# Altium schematic sheet usb-debug.SchDoc: Jetson Xavier NX Board
size A3; PageSetup: Record=PageOptions|CenterHorizontal=True|CenterVertical=True|PrintScale=0.97|XCorrection=1.00|YCorrection=1.00|PrintKind=1|BorderSize=5000000|LeftOffset=0|BottomOffset=0|Orientation=2|PaperLength=2970|PaperWidth=2100|Scale=100|PaperSource=7|PrintQuality=600|MediaType=1|DitherType=10|PaperKind=A4|PrintScaleMode=1; Organization: Altium Limited; Address1: 3 Minna Close; Address2: Belrose; Address3: NSW 2085; Address4: Australia; Revision: Rev01
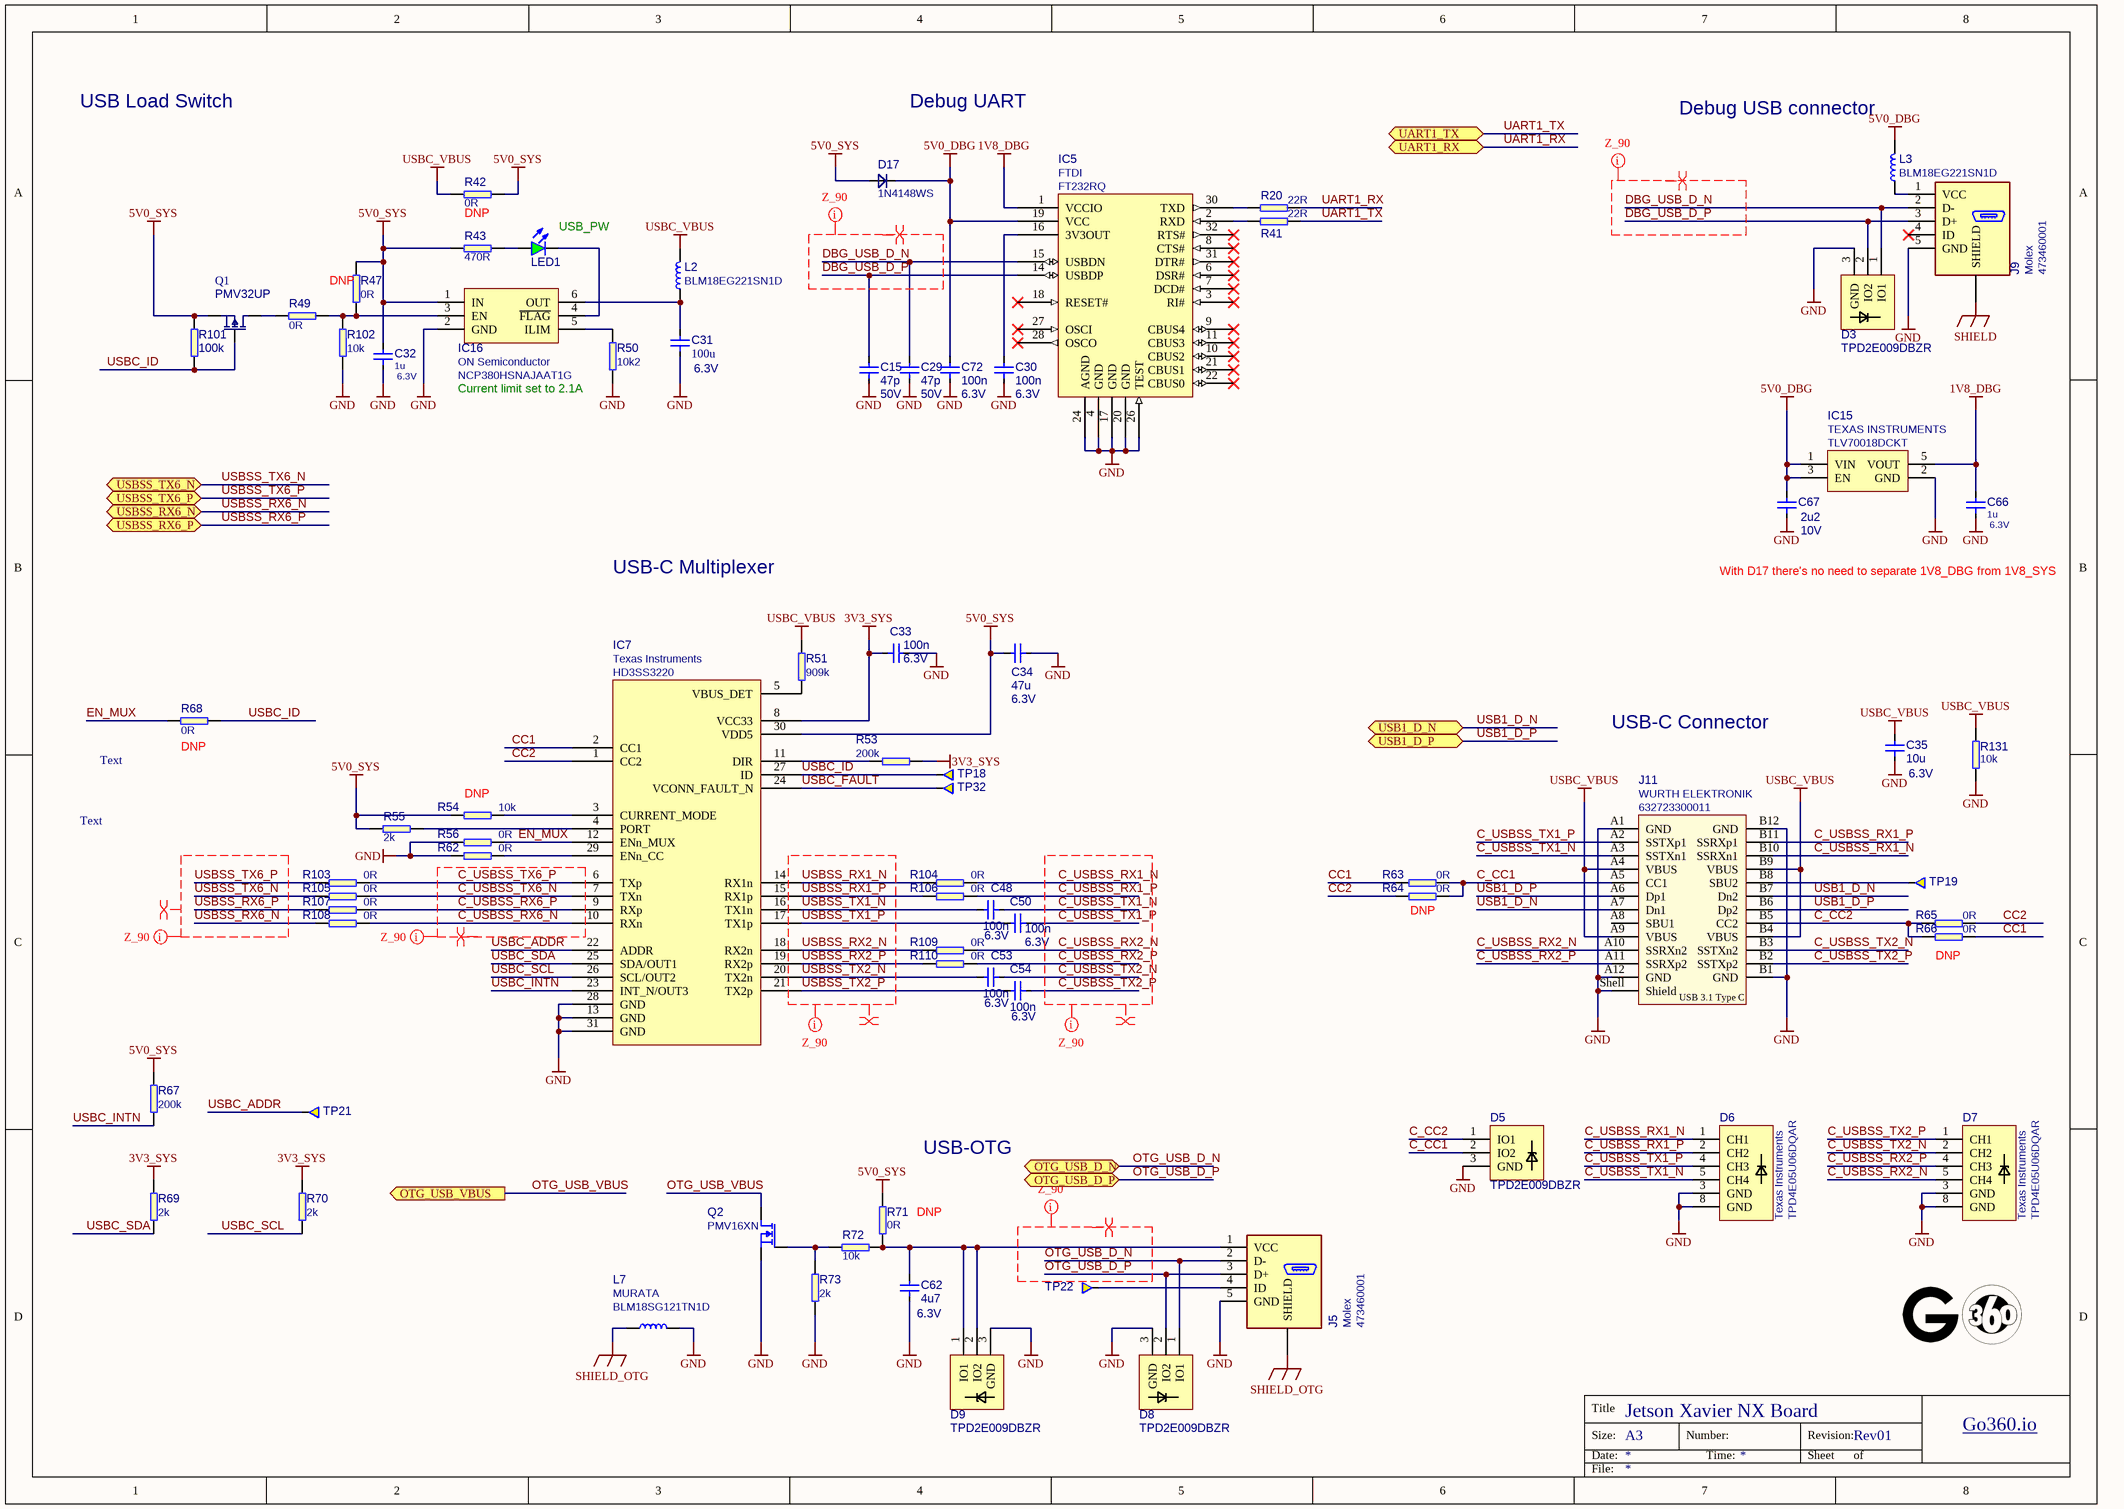
[diagram p0: usb-debug.SchDoc]

## Parts
C15  Voltage: 50V  [0402]  (hidden comment: 47p)
C29  Voltage: 50V  [0402]  (hidden comment: 47p)
C30  Voltage: 6.3V  [0402]  (hidden comment: 100n)
C31  Voltage: 6.3V  [1206]  (hidden comment: 100u)
C32  Voltage: 6.3V  [0402]  (hidden comment: 1u)
C33  Voltage: 6.3V  [0402]  (hidden comment: 100n)
C34  Voltage: 6.3V  [0805]  (hidden comment: 47u)
C35  Voltage: 6.3V  [0603]  (hidden comment: 10u)
C48  Voltage: 6.3V  [0402]  (hidden comment: 100n)
C50  Voltage: 6.3V  [0402]  (hidden comment: 100n)
C53  Voltage: 6.3V  [0402]  (hidden comment: 100n)
C54  Voltage: 6.3V  [0402]  (hidden comment: 100n)
C62  Voltage: 6.3V  [0402]  (hidden comment: 4u7)
C66  Voltage: 6.3V  [0402]  (hidden comment: 1u)
C67  Voltage: 10V  [0402]  (hidden comment: 2u2)
C72  Voltage: 6.3V  [0402]  (hidden comment: 100n)
D3  TPD2E009DBZR  [SOT-23]
D5  TPD2E009DBZR  [SOT-23]
D6  Manufacturer: Texas Instruments  PartSymbol: TPD4E05U06DQAR  [TPD4E05U06_PASS]  (hidden comment: TPD4E05U06)
D7  Manufacturer: Texas Instruments  PartSymbol: TPD4E05U06DQAR  [TPD4E05U06_PASS]  (hidden comment: TPD4E05U06)
D8  TPD2E009DBZR  [SOT-23s]
D9  TPD2E009DBZR  [SOT-23s]
D17  1N4148WS  [SOD-323]
IC5  Manufacturer: FTDI  [QFN-32]  (hidden comment: FT232RQ)
IC7  HD3SS3220  Manufacturer: Texas Instruments  [RNH0030A]
IC15  TLV70018DCKT  Manufacturer: TEXAS INSTRUMENTS  [SC70-5]
IC16  NCP380HSNAJAAT1G  Manufacturer: ON Semiconductor  [TSOP-6]
J5  Manufacturer: Molex  PartSymbol: 473460001  [CON-Molex-047346-0001]  (hidden comment: Molex 47346-0001)
J9  Manufacturer: Molex  PartSymbol: 473460001  [CON-Molex-047346-0001]  (hidden comment: Molex 47346-0001)
J11  632723300011  Manufacturer: WURTH ELEKTRONIK  [WE_632723300011]
L2  BLM18EG221SN1D  [0603]
L3  BLM18EG221SN1D  [0603]
L7  BLM18SG121TN1D  Manufacturer: MURATA  [0603]
LED1  KPT-1608SGC  [LED0603]  (value not drawn)
Q1  PMV32UP  [SOT-23s]
Q2  PMV16XN  [SOT-23s]
R20  22R  [0402]
R41  22R  [0402]
R42  0R  [0402]
R43  470R  [0402]
R47  0R  [0402]
R49  0R  [0402]
R50  10k2  [0402]
R51  909k  [0402]
R53  200k  [0402]
R54  10k  [0402]
R55  2k  [0402]
R56  0R  [0402]
R62  0R  [0402]
R63  0R  [0402]
R64  0R  [0402]
R65  0R  [0402]
R66  0R  [0402]
R67  200k  [0402]
R68  0R  [0402]
R69  2k  [0402]
R70  2k  [0402]
R71  0R  [0402]
R72  10k  [0402]
R73  2k  [0402]
R101  100k  [0402]
R102  10k  [0402]
R103  0R  [0402]
R104  0R  [0402]
R105  0R  [0402]
R106  0R  [0402]
R107  0R  [0402]
R108  0R  [0402]
R109  0R  [0402]
R110  0R  [0402]
R131  10k  [0402]
TP18  Testpad  [TP-R-1.5]  (value not drawn)  (no BOM)
TP19  Testpad  [TP-R-1.5]  (value not drawn)  (no BOM)
TP21  Testpad  [TP-R-1.5]  (value not drawn)  (no BOM)
TP22  Testpad  [TP-R-1.5]  (value not drawn)  (no BOM)
TP32  Testpad  [TP-R-1.5]  (value not drawn)  (no BOM)

## Ports
OTG_USB_D_N, OTG_USB_D_P, OTG_USB_VBUS (out), UART1_RX, UART1_TX, USB1_D_N, USB1_D_P, USBSS_RX6_N, USBSS_RX6_P, USBSS_TX6_N, USBSS_TX6_P

## Nets
1V8_DBG: C66.2 IC5.1(VCCIO) IC15.5(VOUT)
3V3_SYS: C33.1 IC7.8(VCC33) R53.2 R69.1 R70.1
5V0_DBG: C67.2 C72.2 D17.C IC5.19(VCC) IC15.1(VIN) IC15.3(EN) L3.2
5V0_SYS: C32.2 C34.2 D17.A IC7.30(VDD5) IC16.1(IN) Q1.2(S) R42.1 R43.2 R47.2 R54.1 R55.1 R67.2 R71.2 R101.2
GND: C15.1 C29.1 C30.1 C31.1 C32.1 C33.2 C34.1 C35.1 C62.1 C66.1 C67.1 C72.1 D3.3(GND) D5.3(GND) D6.3(GND) D6.8(GND) D7.3(GND) D7.8(GND) D8.3(GND) D9.3(GND) IC5.4(GND) IC5.17(GND) IC5.20(GND) IC5.24(AGND) IC5.26(TEST) IC7.13(GND) IC7.28(GND) IC7.31(GND) IC15.2(GND) IC16.2(GND) J5.5(GND) J9.5(GND) J11.A1(GND) J11.A12(GND) J11.B1(GND) J11.B12(GND) J11.Shell(Shield) L7.2 Q2.2(S) R50.1 R56.1 R62.1 R73.2 R102.1 R131.1
SHIELD: J9.S(SHIELD)
SHIELD_OTG: J5.S(SHIELD) L7.1
USBC_VBUS: C35.2 J11.A4(VBUS) J11.A9(VBUS) J11.B4(VBUS) J11.B9(VBUS) L2.2 R42.2 R51.2 R131.2
C_CC1: D5.2(IO2) J11.A5(CC1) R63.2 R64.2
C_CC2: D5.1(IO1) J11.B5(CC2) R65.1 R66.1
C_USBSS_RX1_N: D6.1(CH1) J11.B10(SSRXn1) R104.2
C_USBSS_RX1_P: D6.2(CH2) J11.B11(SSRXp1) R106.2
C_USBSS_RX2_N: D7.5(CH4) J11.A10(SSRXn2) R109.2
C_USBSS_RX2_P: D7.4(CH3) J11.A11(SSRXp2) R110.2
C_USBSS_RX6_N: IC7.10(RXn) R108.2
C_USBSS_RX6_P: IC7.9(RXp) R107.2
C_USBSS_TX1_N: C48.1 D6.5(CH4) J11.A3(SSTXn1)
C_USBSS_TX1_P: C50.1 D6.4(CH3) J11.A2(SSTXp1)
C_USBSS_TX2_N: C53.1 D7.2(CH2) J11.B3(SSTXn2)
C_USBSS_TX2_P: C54.1 D7.1(CH1) J11.B2(SSTXp2)
C_USBSS_TX6_N: IC7.7(TXn) R105.2
C_USBSS_TX6_P: IC7.6(TXp) R103.2
CC1: IC7.2(CC1) R63.1 R66.2
CC2: IC7.1(CC2) R64.1 R65.2
DBG_USB_D_N: C29.2 D3.1(IO1) IC5.15(USBDN) J9.2(D-)
DBG_USB_D_P: C15.2 D3.2(IO2) IC5.14(USBDP) J9.3(D+)
EN_MUX: IC7.12(ENn_MUX) R56.2 R68.1
OTG_USB_D_N: D8.1(IO1) J5.2(D-) ; port OTG_USB_D_N
OTG_USB_D_P: D8.2(IO2) J5.3(D+) ; port OTG_USB_D_P
OTG_USB_VBUS: Q2.3(D) ; port OTG_USB_VBUS
UART1_RX: R20.2 ; port UART1_RX
UART1_TX: R41.2 ; port UART1_TX
USB1_D_N: J11.A7(Dn1) J11.B7(Dn2) ; port USB1_D_N
USB1_D_P: J11.A6(Dp1) J11.B6(Dp2) ; port USB1_D_P
USBC_ADDR: IC7.22(ADDR) TP21.1
USBC_FAULT: IC7.24(VCONN_FAULT_N) TP32.1
USBC_ID: IC7.27(ID) Q1.1(G) R68.2 R101.1 TP18.1
USBC_INTN: IC7.23(INT_N/OUT3) R67.1
USBC_SCL: IC7.26(SCL/OUT2) R70.2
USBC_SDA: IC7.25(SDA/OUT1) R69.2
USBSS_RX1_N: IC7.14(RX1n) R104.1
USBSS_RX1_P: IC7.15(RX1p) R106.1
USBSS_RX2_N: IC7.18(RX2n) R109.1
USBSS_RX2_P: IC7.19(RX2p) R110.1
USBSS_RX6_N: R108.1 ; port USBSS_RX6_N
USBSS_RX6_P: R107.1 ; port USBSS_RX6_P
USBSS_TX1_N: C48.2 IC7.16(TX1n)
USBSS_TX1_P: C50.2 IC7.17(TX1p)
USBSS_TX2_N: C53.2 IC7.20(TX2n)
USBSS_TX2_P: C54.2 IC7.21(TX2p)
USBSS_TX6_N: R105.1 ; port USBSS_TX6_N
USBSS_TX6_P: R103.1 ; port USBSS_TX6_P
NetC30_2: C30.2 IC5.16(3V3OUT)
NetC31_2: C31.2 IC16.6(OUT) L2.1
NetC62_2: C62.2 D9.1(IO1) D9.2(IO2) J5.1(VCC) R71.1 R72.1
NetIC5_2: IC5.2(RXD) R41.1
NetIC5_30: IC5.30(TXD) R20.1
NetIC7_3: IC7.3(CURRENT_MODE) R54.2
NetIC7_4: IC7.4(PORT) R55.2
NetIC7_5: IC7.5(VBUS_DET) R51.1
NetIC7_11: IC7.11(DIR) R53.1
NetIC7_29: IC7.29(ENn_CC) R62.2
NetIC16_3: IC16.3(EN) R47.1 R49.2 R102.2
NetIC16_4: IC16.4(~{FLAG}) LED1.K
NetIC16_5: IC16.5(ILIM) R50.2
NetJ5_4: J5.4(ID) TP22.1
NetJ9_1: J9.1(VCC) L3.1
NetJ11_B8: J11.B8(SBU2) TP19.1
NetLED1_A: LED1.A R43.1
NetQ1_3: Q1.3(D) R49.1
NetQ2_1: Q2.1(G) R72.2 R73.1

Not connected (* = marked no-connect by the designer): IC5 3(RI#)* 6(DSR#)* 7(DCD#)* 8(CTS#)* 9(CBUS4)* 10(CBUS2)* 11(CBUS3)* 18(RESET#)* 21(CBUS1)* 22(CBUS0)* 27(OSCI)* 28(OSCO)* 31(DTR#)* 32(RTS#)*; J9 4(ID)*; J11 A8(SBU1)

## Layout directives
differential pair: C_USBSS_RX1_N, C_USBSS_RX1_P, C_USBSS_RX2_N, C_USBSS_RX2_P, C_USBSS_RX6_N, C_USBSS_RX6_P, C_USBSS_TX1_N, C_USBSS_TX1_P, C_USBSS_TX2_N, C_USBSS_TX2_P, C_USBSS_TX6_N, C_USBSS_TX6_P, DBG_USB_D_N, DBG_USB_D_P, OTG_USB_D_N, OTG_USB_D_P, USBSS_RX1_N, USBSS_RX1_P, USBSS_RX2_N, USBSS_RX2_P, USBSS_RX6_N, USBSS_RX6_P, USBSS_TX1_N, USBSS_TX1_P, USBSS_TX2_N, USBSS_TX2_P, USBSS_TX6_N, USBSS_TX6_P
net class Z_90: C_USBSS_RX1_N, C_USBSS_RX1_P, C_USBSS_RX2_N, C_USBSS_RX2_P, C_USBSS_RX6_N, C_USBSS_RX6_P, C_USBSS_TX1_N, C_USBSS_TX1_P, C_USBSS_TX2_N, C_USBSS_TX2_P, C_USBSS_TX6_N, C_USBSS_TX6_P, DBG_USB_D_N, DBG_USB_D_P, OTG_USB_D_N, OTG_USB_D_P, USBSS_RX1_N, USBSS_RX1_P, USBSS_RX2_N, USBSS_RX2_P, USBSS_RX6_N, USBSS_RX6_P, USBSS_TX1_N, USBSS_TX1_P, USBSS_TX2_N, USBSS_TX2_P, USBSS_TX6_N, USBSS_TX6_P

## Notes on the sheet
- USB Load Switch
- Debug UART
- (near L3) Debug USB connector
- (near R42) DNP
- (near LED1) USB_PW
- (near R47) DNP
- (near R50) Current limit set to 2.1A
- USB-C Multiplexer
- With D17 there's no need to separate 1V8_DBG from 1V8_SYS
- Text
- (near R68) DNP
- USB-C Connector
- (near R54) DNP
- (near R64) DNP
- (near R66) DNP
- USB-OTG
- DNP
- Title
- Size:
- Date:
- A3
- Number:
- Time:
- Revision:
- Sheet
- of
- Go360.io
- File:
- (in symbol WE_632723300011) USB 3.1 Type C

## Library data of the parts
C15 C29 = C_47p_0402: MLCC SMT Capacitor 47pF 0402; Manufacturer: KEMET; PartSymbol: C0402C470J5GACTU; PartNumber: C_47p_0402; Value: 47p
C30 C33 C72 = C_100n_0402: MLCC SMT Capacitor 100n 0402; Manufacturer: TDK; PartSymbol: C1005X5R0J104K050BA; Value: 100n; PartNumber: C_100n_0402
C31 = C_100u_1206: MLCC SMT Capacitor 100uF 1206; Manufacturer: KEMET; PartSymbol: C1206C107M9PACTU; PartNumber: C_100u_1206; Value: 100u
C32 C66 = C_1u_0402: MLCC SMT Capacitor 1uF 0402; Manufacturer: MULTICOMP; PartSymbol: MC0402F105Z6R3CT; PartNumber: C_1u_0402; Value: 1u
C34 = C_47u_0805: MLCC SMT Capacitor 47uF 0805; Manufacturer: KEMET; PartSymbol: C0805C476M9PACTU; PartNumber: C_47u_0805; Value: 47u
C35 = C_10u_0603: MLCC SMT Capacitor 10uF 0603; Manufacturer: Walsin; PartSymbol: 0603X106M6R3CT; PartNumber: C_10u_0603; Value: 10u
C48 C50 C53 C54 = C_100n_0402: MLCC SMT Capacitor 100n 0402; Manufacturer: TDK; PartSymbol: C1005X5R0J104K050BA; Voltage: 6.3; Value: 100n; PartNumber: C_100n_0402
C62 = C_4u7_0402: MLCC SMT Capacitor 4.7uF 0402; Manufacturer: MURATA; PartSymbol: GRM155R60J475ME87D; PartNumber: C_4u7_0402; Value: 4u7
C67 = C_2u2_0402: MLCC SMT Capacitor 2.2uF 0402; Manufacturer: TDK; PartSymbol: C1005X5R1A225K050BC; Value: 2u2; PartNumber: C_2u2_0402
D3 D5 D8 D9 = TPD2E009DBZR: DIODE, SCHOTTKY, 30V, 200MA, SOT-23; Manufacturer: NXP; PartNumber: TPD2E009DBZR; Value: TPD2E009DBZR; MPN: TPD2E009DBZR
D6 D7 = TPD4E05U06: ESD Suppressors 4-CH; PartNumber: TPD4E05U06_PASS; Value: TPD4E05U06
D17 = diode: Diode small signal; Manufacturer: ON SEMICONDUCTOR; PartNumber: 1N4148WS; Value: 1N4148WS; PartSymbol: 1N4148WS
IC5 = FT232RQ: USB to serial UART interface; PartSymbol: FT232RQ-REEL; Value: FT232RQ; PartNumber: FT232RQ
IC7 = HD3SS3220: IC DRP PORT CTLR USB-C 30WQFN; PartSymbol: HD3SS3220RNHT; PartNumber: HD3SS3220; Value: HD3SS3220
IC15 = TLV700: Voltage Regulator, 2V to 5.5V, 175mV Dropout, 1.8Vout, 200mAout; Value: TLV70018DCKT; PartNumber: TLV70018DCKT; PartSymbol: TLV70018DCKT
IC16 = NCP380HSNAJAAT1G: POWER LOAD SWITCH, HIGH SIDE; Value: NCP380HSNAJAAT1G; PartNumber: NCP380HSNAJAAT1G; PartSymbol: NCP380HSNAJAAT1G
J5 J9 = Micro USB B: USB - micro B Receptacle Connector 5 Position Surface Mount, Right Angle, Horizontal; PartNumber: CON-Molex-47346-0001; Value: Molex 47346-0001
J11 = WE_632723300011: USB 3.1 Type C Receptacle Horizontal THR WR-COM; PartNumber: WE_632723300011; Value: 632723300011; PartSymbol: 632723300011
L2 L3 = BLM18EG221SN1D: MURATA  BLM18EG221SN1D  FERRITE BEAD, 0.05OHM, 2A, 0603; Value: BLM18EG221SN1D; Manufacturer: MURATA; PartNumber: BLM18EG221SN1D; PartSymbol: BLM18EG221SN1D
L7 = BLM18SG121TN1D: FERRITE BEAD, 0.025OHM, 3A, 0603; Value: BLM18SG121TN1D; PartNumber: BLM18SG121TN1D; PartSymbol: BLM18SG121TN1D
LED1 = LED: LED Green 0603 case; Manufacturer: KINGBRIGHT; PartNumber: LED_G; Value: KPT-1608SGC; PartSymbol: KPT-1608SGC
Q1 = PMOS: P CH, 20V, 4A; Manufacturer: NXP; PartNumber: PMV32UP; Value: PMV32UP; PartSymbol: PMV32UP
Q2 = NMOS_PMV16XN: MOSFET, N CH; Manufacturer: NXP; Value: PMV16XN; PartNumber: PMV16XN; PartSymbol: PMV16XN
R20 R41 = R_22R_0402: RES, 22R, 0402; Manufacturer: VISHAY; PartSymbol: CRCW040222R0FKED; Value: 22R; PartNumber: R_22R_0402
R42 R47 R49 R56 R62-R66 R68 R71 R103-R110 = R_0R_0402: RES, 0R, 0402; Manufacturer: Panasonic; PartSymbol: ERJ2GE0R00X; PartNumber: R_0R_0402; Value: 0R
R43 = R_470R_0402: RES, 470R, 0402; Manufacturer: VISHAY; PartSymbol: CRCW0402470RFKED.; PartNumber: R_470R_0402; Value: 470R
R50 = R_10k2_0402: RES, 10k2, 0402, 0.1%; PartNumber: R_10k2_0402_0.1%; Manufacturer: TE CONECTIVITY; PartSymbol: CPF0402B10K2E1; Value: 10k2; Tolerance: 0.1%
R51 = R_909k_0402: RES, 909k, 0402; Manufacturer: Panasonic; PartSymbol: ERJ2RKF9093X; PartNumber: R_909k_0402; Value: 909k
R53 R67 = R_200k_0402: RES, 200k, 0402; Manufacturer: YAGEO; PartSymbol: RC0402FR-07200KL; PartNumber: R_200k_0402; Value: 200k
R54 R72 R102 R131 = R_10k_0402: RES, 10k, 0402; Manufacturer: MULTICOMP; PartSymbol: MCMR04X1002FTL; PartNumber: R_10k_0402; Value: 10k
R55 R69 R70 R73 = R_2k_0402: RES, 2k, 0402; Manufacturer: VISHAY; PartSymbol: CRCW04022K00FKED; PartNumber: R_2k_0402; Value: 2k
R101 = R_100k_0402: SMT Resistor 100k 0402; Manufacturer: VISHAY; PartSymbol: CRCW0402100KFKEDHP; Tolerance: 1%; PartNumber: R_100k_0402; Value: 100k
TP18 TP19 TP21 TP22 TP32 = Testpad: Testpad, round, 1.5mm; PartNumber: TP-R-1.5